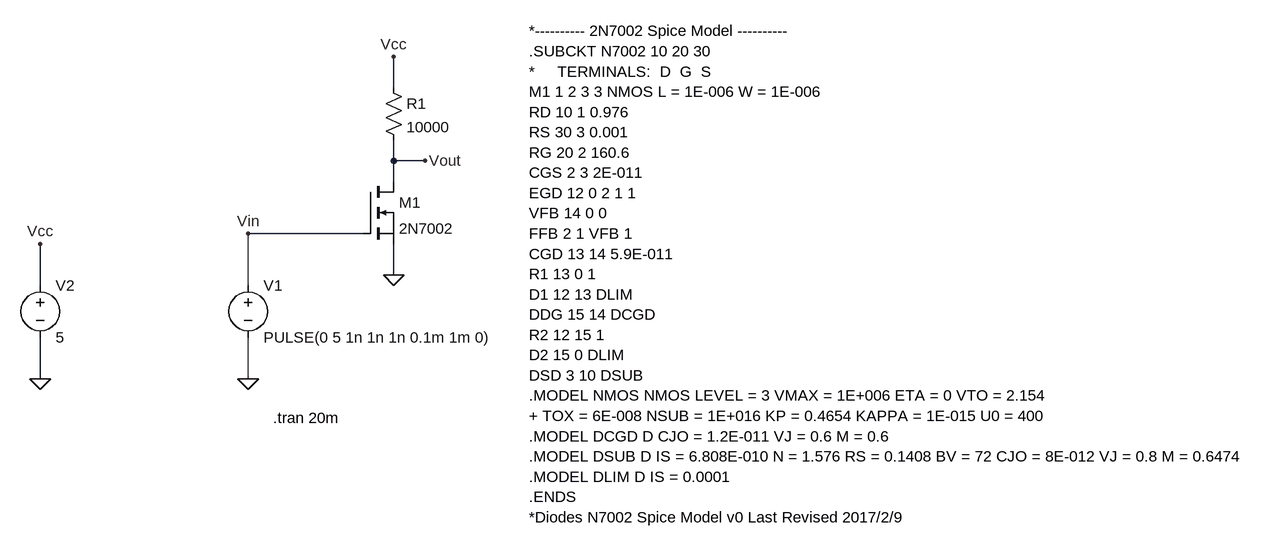
[diagram p0: schematic parte_3.asc]
parte_3.asc, the LTspice schematic file:
Version 4
SHEET 1 1720 680
WIRE 336 -224 336 -272
WIRE 336 -112 336 -144
WIRE 384 -112 336 -112
WIRE 336 -80 336 -112
WIRE 288 0 112 0
WIRE 336 64 336 16
WIRE -208 80 -208 16
WIRE 112 80 112 0
WIRE -208 224 -208 160
WIRE 112 224 112 160
FLAG 112 224 0
FLAG 336 64 0
FLAG 336 -272 Vcc
FLAG 384 -112 Vout
FLAG -208 224 0
FLAG -208 16 Vcc
FLAG 112 0 Vin
SYMBOL voltage 112 64 R0
WINDOW 39 0 0 Left 0
SYMATTR InstName V1
SYMATTR Value PULSE(0 5 1n 1n 1n 0.1m 1m 0)
SYMATTR Value2 AC 0
SYMBOL nmos 288 -80 R0
SYMATTR InstName M1
SYMATTR Value 2N7002
SYMBOL res 320 -240 R0
SYMATTR InstName R1
SYMATTR Value 10000
SYMBOL voltage -208 64 R0
WINDOW 123 0 0 Left 0
WINDOW 39 0 0 Left 0
SYMATTR InstName V2
SYMATTR Value 5
TEXT 544 -312 Left 2 !*---------- 2N7002 Spice Model ----------\n.SUBCKT N7002 10 20 30 \n*     TERMINALS:  D  G  S\nM1 1 2 3 3 NMOS L = 1E-006 W = 1E-006 \nRD 10 1 0.976 \nRS 30 3 0.001 \nRG 20 2 160.6 \nCGS 2 3 2E-011 \nEGD 12 0 2 1 1 \nVFB 14 0 0 \nFFB 2 1 VFB 1 \nCGD 13 14 5.9E-011 \nR1 13 0 1 \nD1 12 13 DLIM \nDDG 15 14 DCGD \nR2 12 15 1 \nD2 15 0 DLIM \nDSD 3 10 DSUB \n.MODEL NMOS NMOS LEVEL = 3 VMAX = 1E+006 ETA = 0 VTO = 2.154 \n+ TOX = 6E-008 NSUB = 1E+016 KP = 0.4654 KAPPA = 1E-015 U0 = 400 \n.MODEL DCGD D CJO = 1.2E-011 VJ = 0.6 M = 0.6 \n.MODEL DSUB D IS = 6.808E-010 N = 1.576 RS = 0.1408 BV = 72 CJO = 8E-012 VJ = 0.8 M = 0.6474 \n.MODEL DLIM D IS = 0.0001 \n.ENDS\n*Diodes N7002 Spice Model v0 Last Revised 2017/2/9
TEXT 150 284 Left 2 !.tran 20m

The netlist it stands for:
* parte_3.asc
V1 Vin 0 PULSE(0 5 1n 1n 1n 0.1m 1m 0) AC 0
M1 Vout Vin 0 0 2N7002
R1 Vcc Vout 10000
V2 Vcc 0 5
.model NMOS NMOS
.model PMOS PMOS
.lib standard.mos
*---------- 2N7002 Spice Model ----------
.SUBCKT N7002 10 20 30
*     TERMINALS:  D  G  S
M1 1 2 3 3 NMOS L = 1E-006 W = 1E-006
RD 10 1 0.976
RS 30 3 0.001
RG 20 2 160.6
CGS 2 3 2E-011
EGD 12 0 2 1 1
VFB 14 0 0
FFB 2 1 VFB 1
CGD 13 14 5.9E-011
R1 13 0 1
D1 12 13 DLIM
DDG 15 14 DCGD
R2 12 15 1
D2 15 0 DLIM
DSD 3 10 DSUB
.MODEL NMOS NMOS LEVEL = 3 VMAX = 1E+006 ETA = 0 VTO = 2.154
+ TOX = 6E-008 NSUB = 1E+016 KP = 0.4654 KAPPA = 1E-015 U0 = 400
.MODEL DCGD D CJO = 1.2E-011 VJ = 0.6 M = 0.6
.MODEL DSUB D IS = 6.808E-010 N = 1.576 RS = 0.1408 BV = 72 CJO = 8E-012 VJ = 0.8 M = 0.6474
.MODEL DLIM D IS = 0.0001
.ENDS
*Diodes N7002 Spice Model v0 Last Revised 2017/2/9
.tran 20m
.backanno
.end